# Altium project DE-180824.PrjPcb
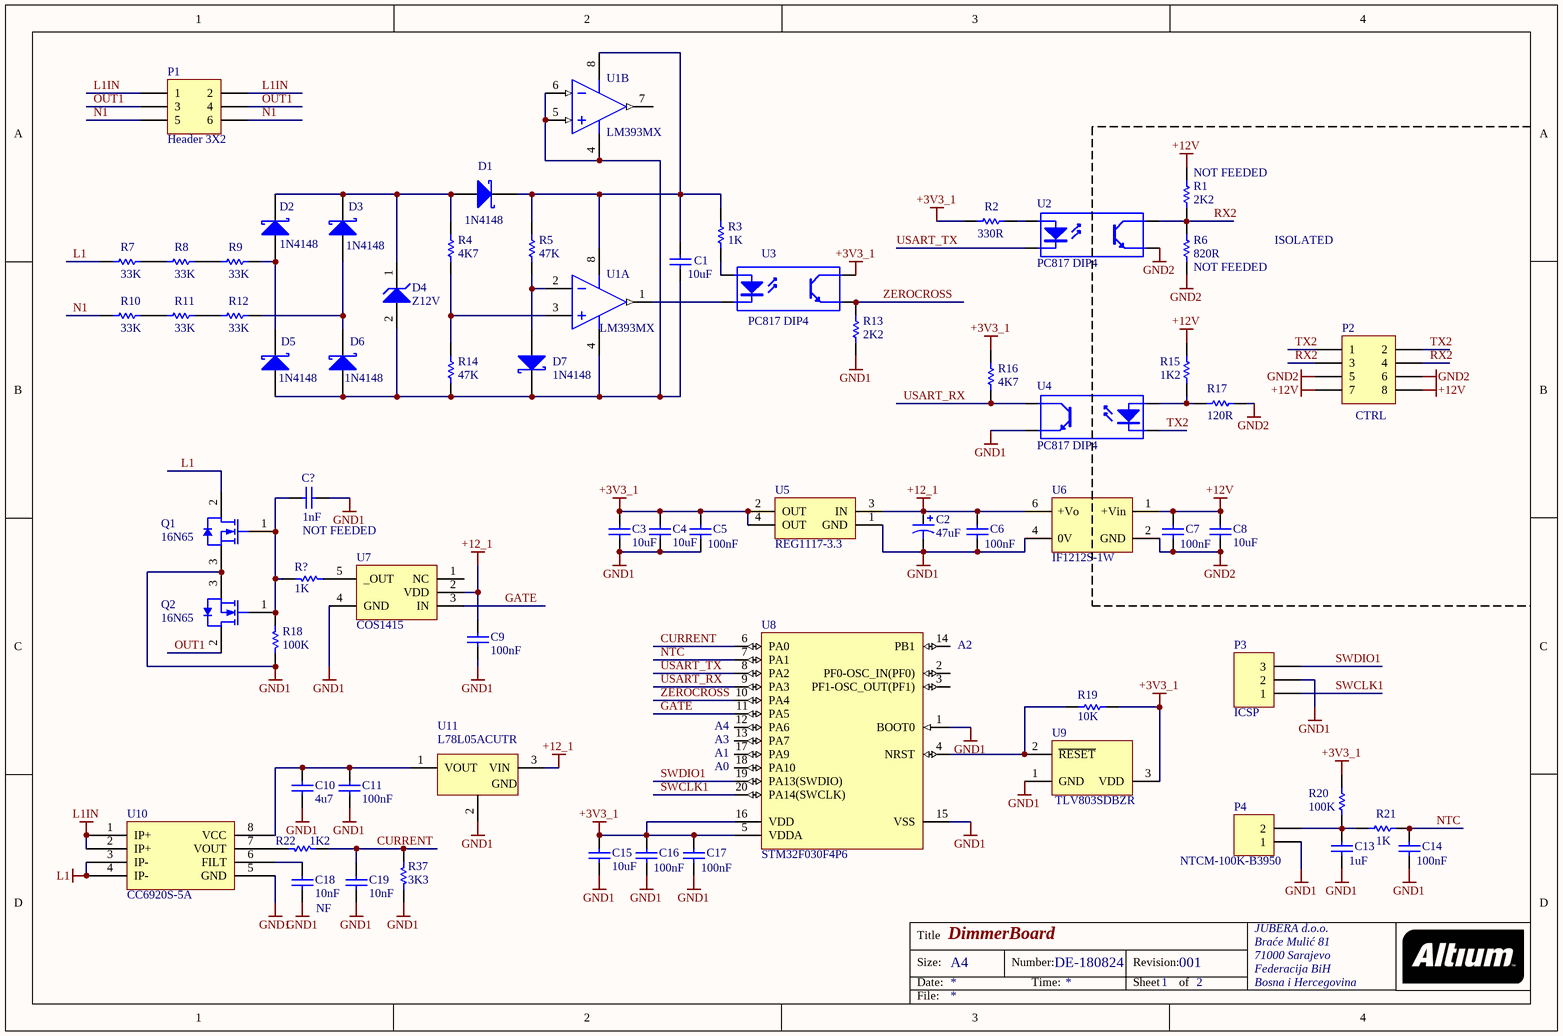
[diagram p0: DE-180824.SchDoc]
2 sheets, 134 parts. Net scope: global (net labels, ports and power ports of the same name join across sheets).
Board files: DE-180824.PcbDoc, PCB_BaseBoard.PcbDoc, PCB_ControlBoard.PcbDoc, PCB_DimmerBard.PcbDoc
Sheets:
  DE-180824.SchDoc
  DE-180824_1.SchDoc

## Sheet DE-180824.SchDoc: DimmerBoard
size A4; Author: eldar6776@hotmail.com; DrawnBy: Eldar Dedic; Organization: JUBERA d.o.o.; Address1: Braće Mulić 81; Address2: 71000 Sarajevo; Address3: Federacija BiH; Address4: Bosna i Hercegovina; DocumentNumber: DE-180824; Revision: 001; SheetNumber: 1; SheetTotal: 2; SPICEModelCacheBVBUIEPD: <root> / <DocumentId>BVBUIEPD</DocumentId> / </root>

### Parts
(Parts that share a designator on the sheet are numbered #1, #2 ... from top to bottom, then left to right.)
C1  value 10uF  [0805]
C2  47uF  [H]
C3  value 10uF  [0805]  (hidden comment: C0805)
C4  value 10uF  [0805]  (hidden comment: C0805)
C5  value 100nF  [0603]  (hidden comment: C0603)
C6  value 100nF  [0603]  (hidden comment: C0603)
C7  value 100nF  [0603]  (hidden comment: C0603)
C8  value 10uF  [0805]  (hidden comment: C0805)
C9  value 100nF  [0603]  (hidden comment: C0603)
C10  value 4u7  [0805]
C11  value 100nF  [0603]
C13  value 1uF  [0603]  (hidden comment: C0603)
C14  value 100nF  [0603]  (hidden comment: C0603)
C15  value 10uF  [0805]  (hidden comment: C0805)
C16  value 100nF  [0603]  (hidden comment: C0603)
C17  value 100nF  [0603]  (hidden comment: C0603)
C18  value 10nF  [0603]
C19  value 10nF  [0603]
C?  value 1nF  [0603]  (hidden comment: C0603)
D1  1N4148  [SOD323]
D2  1N4148  [SOD323]
D3  1N4148  [SOD323]
D4  Z12V  [ONSC-SOD-323-2-477-02_V]
D5  1N4148  [SOD323]
D6  1N4148  [SOD323]
D7  1N4148  [SOD323]
P1  Header 3X2  [HDR2X3]
P2  CTRL  [HDR2X4]
P3  ICSP  [HDR1X3]
P4  NTCM-100K-B3950  [HDR1X2]
Q1  16N65  [INF-PG-TO263-3-2_N]
Q2  16N65  [INF-PG-TO263-3-2_N]
R1  value 2K2  [ERA-0603]
R2  value 330R  [ERA-0603]  (hidden comment: 10K)
R3  value 1K  [ERA-0603]
R4  4K7  [ERA-0603]
R5  value 47K  [ERA-0603]
R6  value 820R  [ERA-0603]
R7  value 33K  [ERA-0805]
R8  value 33K  [ERA-0805]
R9  value 33K  [ERA-0805]
R10  value 33K  [ERA-0805]
R11  value 33K  [ERA-0805]
R12  value 33K  [ERA-0805]
R13  value 2K2  [ERA-0603]
R14  47K  [ERA-0603]
R15  value 1K2  [ERA-0603]
R16  value 4K7  [ERA-0603]  (hidden comment: 10K)
R17  value 120R  [ERA-0603]
R18  100K  [ERA-0805]
R19  10K  [ERA-0603]
R20  value 100K  [ERA-0603]  (hidden comment: 10K)
R21  1K  [ERA-0603]
R22  value 1K2  [ERA-0603]
R37  value 3K3  [ERA-0603]
R?#1  value 1K  [ERA-0805]  (hidden comment: 100K)
U1  LM393MX  [M08A_N]  (parts A,B of 2)
U2  PC817 DIP4  [DIP-4]
U3  PC817 DIP4  [DIP-4]
U4  PC817 DIP4  [DIP-4]
U5  REG1117-3.3  [ZZ311]
U6  IF1212S-1W  [IF1212S-1W]
U7  COS1415  [SOT23-5]
U8  STM32F030F4P6  [STM-TSSOP20_N]
U9  TLV803SDBZR  [DBZ3_N]
U10  CC6920S-5A  [SOIC-SN8_N]
U11  L78L05ACUTR  [SOT-89_N]

### Nets
+3V3_1: C3.2 C4.2 C5.2 C15.2 C16.2 C17.2 R2.2 R16.2 R19.2 R20.2 U3.4(C) U5.2(OUT) U5.4(OUT) U8.5(VDDA) U8.16(VDD) U9.3(VDD)
+12_1: C2.1 C6.2 C9.2 U5.3(IN) U6.6(+Vo) U7.2(VDD) U11.3(VIN)
+12V: C7.2 C8.2 P2.7 P2.8 R1.1 R15.1 U6.1(+Vin)
GND1: C2.2 C3.1 C4.1 C5.1 C6.1 C9.1 C10.1 C11.1 C13.1 C14.1 C15.1 C16.1 C17.1 C18.1 C19.1 C?.2 P3.2 P4.1 Q1.3(SOURCE) Q2.3(SOURCE) R13.1 R18.1 R37.2 U4.3(E) U5.1(GND) U6.4(0V) U7.4(GND) U8.1(BOOT0) U8.15(VSS) U9.1(GND) U10.5(GND) U11.2(GND)
GND2: C7.1 C8.1 P2.5 P2.6 R6.2 R17.2 U2.3(E) U6.2(GND)
L1: Q1.2(DRAIN) R7.1 U10.3(IP-) U10.4(IP-)
L1IN: P1.1 P1.2 U10.1(IP+) U10.2(IP+)
CURRENT: C19.2 R22.1 R37.1 U8.6(PA0)
GATE: U7.3(IN) U8.11(PA5)
N1: P1.5 P1.6 R10.1
NTC: C14.2 R21.1 U8.7(PA1)
OUT1: P1.3 P1.4 Q2.2(DRAIN)
RX2: P2.3 P2.4 R1.2 R6.1 U2.4(C)
SWCLK1: P3.1 U8.20(PA14(SWCLK))
SWDIO1: P3.3 U8.19(PA13(SWDIO))
TX2: P2.1 P2.2 U4.2(K)
USART_RX: R16.1 U4.4(C) U8.9(PA3)
USART_TX: U2.2(K) U8.8(PA2)
ZEROCROSS: R13.2 U3.3(E) U8.10(PA4)
NetC1_1: C1.1 D4.2(A) D5.2(A) D6.2(A) D7.1(K) R14.1 U1.4(GND) U1.5(INB+) U1.6(INB-)
NetC1_2: C1.2 D1.1(K) R3.2 R5.2 U1.8(V+)
NetC10_2: C10.2 C11.2 U10.8(VCC) U11.1(VOUT)
NetC13_2: C13.2 P4.2 R20.1 R21.2
NetC18_2: C18.2 U10.6(FILT)
NetC?_1: C?.1 Q1.1(GATE) Q2.1(GATE) R18.2 R?#1.2
NetD1_2: D1.2(A) D2.1(K) D3.1(K) D4.1(K) R4.2
NetD2_2: D2.2(A) D5.1(K) R9.2
NetD3_2: D3.2(A) D6.1(K) R12.2
NetD7_2: D7.2(A) R5.1 U1.2(INA-)
NetR2_1: R2.1 U2.1(A)
NetR3_1: R3.1 U3.1(A)
NetR4_1: R4.1 R14.2 U1.3(INA+)
NetR7_2: R7.2 R8.1
NetR8_2: R8.2 R9.1
NetR10_2: R10.2 R11.1
NetR11_2: R11.2 R12.1
NetR15_2: R15.2 R17.1 U4.1(A)
NetR19_1: R19.1 U8.4(NRST) U9.2(~{RESET})
NetR22_2: R22.2 U10.7(VOUT)
NetU1_1: U1.1(OUTA) U3.2(K)

Not connected (* = marked no-connect by the designer): R?#1 1; U1 7(OUTB); U7 1(NC) 5(_OUT); U8 2(PF0-OSC_IN(PF0)) 3(PF1-OSC_OUT(PF1)) 12(PA6) 13(PA7) 14(PB1) 17(PA9) 18(PA10)

### Notes on the sheet
- (near R1) NOT FEEDED
- ISOLATED
- (near R6) NOT FEEDED
- NOT FEEDED
- (near U8) A2
- (near U8) A4
- (near U8) A3
- (near U8) A1
- (near U8) A0
- NF
- Title
- Size:
- Date:
- Number:
- Time:
- Revision:
- Sheet
- of
- File:

### Library data of the parts
C1 C3 C4 C8 C10 C15 = C0805: Ceramic Chip Capacitor - Standard; Note: Footprint corresponds to dimensions for bulk cassette packaging. This case size has tightened tolerances.; Published: 17-Jul-2002; LatestRevisionDate: 19-Mar-2004; LatestRevisionNote: Silkscreen size reduced.; DatasheetDocument: Mar-2001; PackageDocument: Mar-2001; PackageReference: 0805; Publisher: Altium Limited; Code_JEITA: 0805; Code_IPC: 2012[0805]; ComponentLink1Description: Manufacturer Link; ComponentLink1URL: http://www.kemet.com/; ComponentLink2Description: Datasheet; ComponentLink2URL: http://www.kemet.com/kemet/web/homepage/kechome.nsf/vapubfilesname/F3102TA.pdf/$file/F3102TA.pdf
C2 = 194D476X0015H2: Midget Conformal Coated Solid Tantalum Chip Capacitor: 47uF, 20% Tolerance, 15 WVDC @ +85°C, Surge = 20V; Note: See Data Sheet for full range of components; Published: 19-Mar-2004; DatasheetDocument: 05-Jul-2002; PackageReference: H; Publisher: Altium Limited; ComponentLink1Description: Manufacturer Link; ComponentLink1URL: http://www.vishay.com/; ComponentLink2Description: Datasheet; ComponentLink2URL: http://www.vishay.com/docs/40000/194d.pdf; Value: 47uF
C5-C7 C9 C11 C13 C14 C16-C19 C? = C0603: Ceramic Chip Capacitor - Standard; Note: Footprint corresponds to dimensions for bulk cassette packaging. This case size has tightened tolerances.; Published: 17-Jul-2002; LatestRevisionDate: 19-Mar-2004; LatestRevisionNote: Silkscreen size reduced.; DatasheetDocument: Mar-2001; PackageDocument: Mar-2001; PackageReference: 0603; Publisher: Altium Limited; Code_JEITA: 0603; Code_IPC: 1608 [0603]; ComponentLink1Description: Manufacturer Link; ComponentLink1URL: http://www.kemet.com/; ComponentLink2Description: Datasheet; ComponentLink2URL: http://www.kemet.com/kemet/web/homepage/kechome.nsf/vapubfilesname/F3102TA.pdf/$file/F3102TA.pdf
D1-D3 D5-D7 = 1PS76SB10: Schottky Barrier Diode; Published: 17-Sep-2003; LatestRevisionDate: 19-Mar-2004; LatestRevisionNote: Silkscreen size reduced.; DatasheetVersion: 14-Oct-1996; PackageVersion: May-1999; PackageReference: SOD323; Publisher: Altium Limited; PackageDescription: SOD-323/SC-76; 2 Leads; Body 1.7 x 1.3 mm, (LxW); ComponentLink1Description: Manufacturer Link; ComponentLink1URL: http://www.semiconductors.philips.com/; ComponentLink2Description: Datasheet; ComponentLink2URL: http://www.semiconductors.philips.com/acrobat/datasheets/1PS76SB10_2.pdf
D4 = SZMM3Z12VT1G: Zener Voltage Regulator, 300 mW, 2-Pin SOD-323, Pb-Free, Tape and Reel; Manufacturer: On Semiconductor; P Max (W): 0.3; VZ Typ (V): 12; DatasheetVersion: Rev. 9; PackageVersion: Rev. H, 03/2007; PackageReference: SOD-323-2-477-02; PackageDescription: 2-Pin SOD, Body 1.7 x 1.25 mm; Supplier 1: Digi-Key; Supplier Part Number 1: SZMM3Z12VT1G-ND; Supplier 2: Mouser; Supplier Part Number 2: 863-SZMM3Z12VT1G; Packing: Tape and Reel; RoHS: Pb-Free; Mounting Technology: Surface Mount; PartNumber: SZMM3Z12VT1G; ComponentLink1Description: Manufacturer URL; ComponentLink1URL: http://www.onsemi.com/; ComponentLink2Description: Datasheet; ComponentLink2URL: http://www.onsemi.cn/pub_link/Collateral/MM3Z2V4T1-D.PDF; ComponentLink3Description: Package Specification; ComponentLink3URL: http://www.onsemi.com/pub_link/Collateral/477-02.PDF.1
P1 = Header 3X2: Header, 3-Pin, Dual row; LatestRevisionDate: 17-Jul-2002; LatestRevisionNote: Re-released for DXP Platform.; Publisher: Altium Limited
P2 = Header 4X2: Header, 4-Pin, Dual row; LatestRevisionDate: 17-Jul-2002; LatestRevisionNote: Re-released for DXP Platform.; Publisher: Altium Limited
P3 = Header 3: Header, 3-Pin; LatestRevisionDate: 17-Jul-2002; LatestRevisionNote: Re-released for DXP Platform.; Publisher: Altium Limited
P4 = Header 2: Header, 2-Pin; LatestRevisionDate: 17-Jul-2002; LatestRevisionNote: Re-released for DXP Platform.; Publisher: Altium Limited
Q1 Q2 = IPB020NE7N3 G: N-Channel OptiMOS 3 Power-Transistor, 75 V VDS, 120 A ID, -55 to 175 degC, PG-TO263-3-2, Reel, Green; Manufacturer: Infineon; Green: TRUE; ID (max): 120 A; IDpuls (max): 480 A; Polarity: N; Ptot (max): 300 W; QG: 155 nC; RDS (on) (max): 2 mOhm; Rth: 0.5 K/W; RthJA (max): 62 K/W; VDS (max): 75 V; VGS(th) (max): 3.8 V; VGS(th) (min): 2.3 V; DatasheetVersion: Rev. 2.2; PackageVersion: Jul-09; PackageReference: PG-TO263-3-2; PackageDescription: 3-Pin Plastic (Green) Transistor Single Outline Package, 10 x 9.25 mm Body, 2.54 mm Pitch; Supplier 1: Mouser; Supplier Part Number 1: 726-IPB020NE7N3GXT; Supplier 2: Digi-Key; Supplier Part Number 2: IPB020NE7N3 GTR-ND; Supplier 3: Digi-Key; Supplier Part Number 3: IPB020NE7N3 GCT-ND; Supplier 4: Digi-Key; Supplier Part Number 4: IPB020NE7N3 GDKR-ND; Halogen-free: TRUE; Packing: Reel; RthJC (max): 0.5 K/W; Mounting Technology: Surface Mount; PartNumber: IPB020NE7N3 G; ComponentLink1Description: Manufacturer URL; ComponentLink1URL: http://www.infineon.com/; ComponentLink2Description: Datasheet; ComponentLink2URL: http://www.infineon.com/dgdl/IPB020NE7N3_Rev2.2.pdf?folderId=db3a304313b8b5a60113cee8763b02d7&fileId=db3a304320d39d590121e31c838554d3; ComponentLink3Description: Package Specification; ComponentLink3URL: http://www.infineon.com/dgdl/BTS141TC_DS_10.pdf?folderId=db3a3043163797a6011667aa084c0e01&fileId=db3a3043242ebc9e01242f43f58b003e&location=en.Products.Automotive_ICs.Smart_High-_and_Low-Side_Switches.HITFET___TEMPFET__-_Smart_Low-Side_Switches.DATASHEET.BTS141TC_DS_10.pdf
R1-R6 R13-R17 R19-R22 R37 = ERA3Y: Rectangular Thick Film Chip Resistor, 10 Ohm to 330k Ohm Range, 0.1% and 0.5% Tolerance, 0603 Size, 0.063 W; Note: If flow soldering, adjust pad width of PCB Footprint to 0.7 - 0.8 times the width of the resistor.; Published: 17-Dec-2003; LatestRevisionDate: 19-Mar-2004; LatestRevisionNote: Silkscreen size reduced.; PackageDocument: Mar-2003; PackageReference: ERA-0603; Publisher: Altium Limited; Code_IPC: 1608 [0603]; ComponentLink1Description: Manufacturer Link; ComponentLink1URL: http://www.panasonic.com/industrial/components/resistive_products.htm; ComponentLink2Description: Datasheet; ComponentLink2URL: http://www.panasonic.com/industrial/components/pdf/AOA0000CE8.pdf
  R21: Value: 1K
R7-R12 = ERA6Y: Rectangular Thick Film Chip Resistor, 10 Ohm to 1M Ohm Range, 0.1% and 0.5% Tolerance, 0805 Size, 0.1 W; Note: If flow soldering, adjust pad width of PCB Footprint to 0.7 - 0.8 times the width of the resistor.; Published: 17-Dec-2003; LatestRevisionDate: 19-Mar-2004; LatestRevisionNote: Silkscreen size reduced.; PackageDocument: Mar-2003; PackageReference: ERA-0805; Publisher: Altium Limited; Code_IPC: 2012 [0805]; ComponentLink1Description: Manufacturer Link; ComponentLink1URL: http://www.panasonic.com/industrial/components/resistive_products.htm; ComponentLink2Description: Datasheet; ComponentLink2URL: http://www.panasonic.com/industrial/components/pdf/AOA0000CE8.pdf
R18 R?#1 = ERAS: Metal Film Thermosensitive Chip Resistor, 0.56 Ohm to 10k Ohm Range, 5% Tolerance, 0805 Size, 0.1 W; Note: If flow soldering, adjust pad width of PCB Footprint to 0.7 - 0.8 times the width of the resistor.; Published: 17-Dec-2003; LatestRevisionDate: 19-Mar-2004; LatestRevisionNote: Silkscreen size reduced.; PackageDocument: Mar-2003; PackageReference: ERA-0805; Publisher: Altium Limited; Code_IPC: 2012 [0805]; ComponentLink1Description: Manufacturer Link; ComponentLink1URL: http://www.panasonic.com/industrial/components/resistive_products.htm; ComponentLink2Description: Datasheet; ComponentLink2URL: http://www.panasonic.com/industrial/components/pdf/AOF0000CE1.pdf
  R18: Value: 100K
U1 = LM393MX: Low Power Low Offset Voltage Dual Comparator, 8-pin Narrow SOIC; Manufacturer: National Semiconductor; PackageTopMarking: NSZXTT*LM*393M; PowerWise: N; High-Reliability: Y; DatasheetVersion: Aug-2002; PackageVersion: revM, May-2009; PackageReference: M08A; PackageDescription: SOIC Narrow, 4.9 x 3.9 x 1.45mm, 8 Lead, 1.27mm Pitch; PartNumber: LM393MX; RoHS: N; PinCount: 8; CompType: Comparator; Code_JEDEC: MS-012-AA; Code_IPC: SOIC127P600-8; ComponentLink1Description: Manufacturer URL; ComponentLink1URL: http://www.national.com/; ComponentLink2Description: LM393 Datasheet; ComponentLink2URL: http://www.national.com/ds/LM/LM393.pdf; ComponentLink3Description: LM393 Web Page; ComponentLink3URL: http://www.national.com/pf/LM/LM393.html; ComponentLink4Description: M08A Package Page; ComponentLink4URL: http://www.national.com/packaging/folders/m08a.html
U2-U4 = PC817 DIP4: 4-Pin Phototransistor Optocoupler; Published: 24-Mar-1999; LatestRevisionDate: 04-Mar-2005; LatestRevisionNote: Sch pins 3 & 4 Swapped.; DatasheetVersion: Nov-2003; PackageReference: DIP-4; Publisher: Altium Limited
U5 = REG1117-3.3: 800mA and 1A Low Dropout Positive Regulator 2.85V, 3.3V, 5V, and Adjustable; Published: 8-Jun-2000; LatestRevisionDate: 17-Jul-2002; LatestRevisionNote: Re-released for DXP Platform.; DatasheetVersion: Sep-1997; PackageVersion: revC; PackageReference: ZZ311; Publisher: Altium Limited; PackageDescription: SOT-223/SC-73; 4 Leads; Body 6.7 x 7.3 mm, inc. leads (LxW max); ComponentLink1Description: Manufacturer Link; ComponentLink1URL: http://www.ti.com/; ComponentLink2Description: Datasheet; ComponentLink2URL: http://www-s.ti.com/sc/ds/REG1117.pdf
U6 = IF1212S-1W: 1W isolated dc dc converter
U7 = COS1415: 1.5A Single-Channel / High-Speed Power MOSFETDriver
U8 = STM32F030F4P6: ARM Cortex-M0 32-bit MCU, 16 KB Flash, 4 KB Internal RAM, 15 I/Os, 20-pin TSSOP, -40 to 85 degC, Tube; FLASH Size (Prog) (kB): 16; I/Os (High Current): 15; Internal RAM Size (kB): 4; Operating Frequency(F) (Processor speed) (MHz): 48; Supply Voltage(Vcc) min (V): 2.4; DatasheetVersion: Rev. 1; PackageVersion: Rev. 1, 11/2012; PackageReference: TSSOP20; PackageDescription: 20-Pin Thin Shrink Small Outline Package, 6.5 x 4.4 mm Body, 0.65 mm Pitch; Supplier 1: Digi-Key; Supplier Part Number 1: 497-14044-5-ND; Supplier 2: Newark; Supplier Part Number 2: 06X3648; Supplier 3: Mouser; Supplier Part Number 3: 511-STM32F030F4P6; Core: ARM Cortex-M0; Packing: Tube; Mounting Technology: Surface Mount; PartNumber: STM32F030F4P6; ComponentLink1Description: Manufacturer URL; ComponentLink1URL: http://www.st.com/web/en/home.html; ComponentLink2Description: Datasheet; ComponentLink2URL: http://www.st.com/st-web-ui/static/active/en/resource/technical/document/datasheet/DM00088500.pdf; ComponentLink3Description: Package Specification; ComponentLink3URL: http://www.st.com/st-web-ui/static/active/en/resource/technical/document/datasheet/DM00065136.pdf
U9 = TLV803MDBZR: Voltage Supervisor with Active-Low, Open Drain Reset, 1 Supply Monitored, -40 to 125 degC, 3-pin SOT-23 (DBZ), Green (RoHS & no Sb/Br); Manufacturer: Texas Instruments; # of supplies monitored: 1; Iq(Typ)(uA): 9; Output Driver Type / Reset Output: Active-low, Open-drain; Rating: Catalog; Reset Threshold Accuracy(%): 2; SubFamily: Supervisor and Reset IC; Threshold Voltage 1 (typ)(Typ)(V): 4.38; Time Delay(ms): 200; VCC(Max)(V): 6; VCC(Min)(V): 1.1; DatasheetVersion: SBVS157B; PackageVersion: revB, Apr-2005; PackageReference: DBZ3; PackageDescription: 3-Pin Plastic Small-Outline Package, 0.95 mm Pitch, 2.4 mm Lead Span; Supplier 1: Digi-Key; Supplier Part Number 1: 296-29194-2-ND; Supplier 2: Digi-Key; Supplier Part Number 2: 296-29194-1-ND; Supplier 3: Digi-Key; Supplier Part Number 3: 296-29194-6-ND; Supplier 4: Newark; Supplier Part Number 4: 58T0286; Supplier 5: Mouser; Supplier Part Number 5: 595-TLV803MDBZR; Mounting Technology: Surface Mount; Code_JEDEC: TO-236-AB; PartNumber: TLV803MDBZR; ComponentLink1Description: Datasheet; ComponentLink1URL: http://www.ti.com/general/docs/lit/getliterature.tsp?genericPartNumber=TLV803M&fileType=pdf
U10 = ACS71240
U11 = L78L05ACUTR: Positive Voltage Regulator, 5V, 4-Pin SOT-89, Tape and Reel; DatasheetVersion: Feb-2011; PackageVersion: 2011; PackageReference: SOT-89; PackageDescription: 3-Pin SOT-89 Package 1.5 mm Pitch, 4.1 mm Lead Span; PartNumber: L78L05ACUTR; ComponentLink1Description: Manufacturer URL; ComponentLink1URL: http://www.st.com; ComponentLink2Description: Datasheet; ComponentLink2URL: http://www.st.com/internet/com/TECHNICAL_RESOURCES/TECHNICAL_LITERATURE/DATASHEET/CD00000446.pdf

## Sheet DE-180824_1.SchDoc: DimmerBaseBoard
size A3; Author: eldar6776@hotmail.com; DrawnBy: Eldar Dedic; Organization: JUBERA d.o.o.; Address1: Braće Mulić 81; Address2: 71000 Sarajevo; Address3: Federacija BiH; Address4: Bosna i Hercegovina; DocumentNumber: DE-180824; Revision: 001; SheetNumber: 2; SheetTotal: 2; SPICEModelCacheBVBUIEPD: <root> / <DocumentId>BVBUIEPD</DocumentId> / <CacheFrame Number="0"> / <Model Name="dpsw6" Kind="CKT"> / <Text>* DIP switch 6 / * jjt 20/6/2002: created / * / *             Switch connections: / *             sw1 / *             |  |  sw2 / *             |  |  |  |  sw3 / *             |  |  |  |  |  |   sw4 / *             |  |  |  |  |  |  |   |    sw5 / *             |  |  |  |  |  |  |   |   |   |    sw6 / *             |  |  |  |  |  |  |   |   |   |   |   | / *             |  |  |  |  |  |  |   |   |   |   |   | / .subckt dpsw6 1  2  4  5  7  8  10  11  13  14  16  17 / + PARAMS: STATE1=0 STATE2=0 STATE3=0 STATE4=0 STATE5=0 STATE6=0 RON=1m ROFF=100E6 / * / V1 3  0 {STATE1} / V2 6  0 {STATE2} / V3 9  0 {STATE3} / V4 12 0 {STATE4} / V5 15 0 {STATE5} / V6 18 0 {STATE6} / * / SDIP1 1  2  3  0 DIPMOD / SDIP2 4  5  6  0 DIPMOD / SDIP3 7  8  9  0 DIPMOD / SDIP4 10 11 12 0 DIPMOD / SDIP5 13 14 15 0 DIPMOD / SDIP6 16 17 18 0 DIPMOD / * / .MODEL DIPMOD SW(VT=0.5 RON={RON} ROFF={ROFF}) / .ends dpsw6</Text> / </Model> / </CacheFrame> / </root>
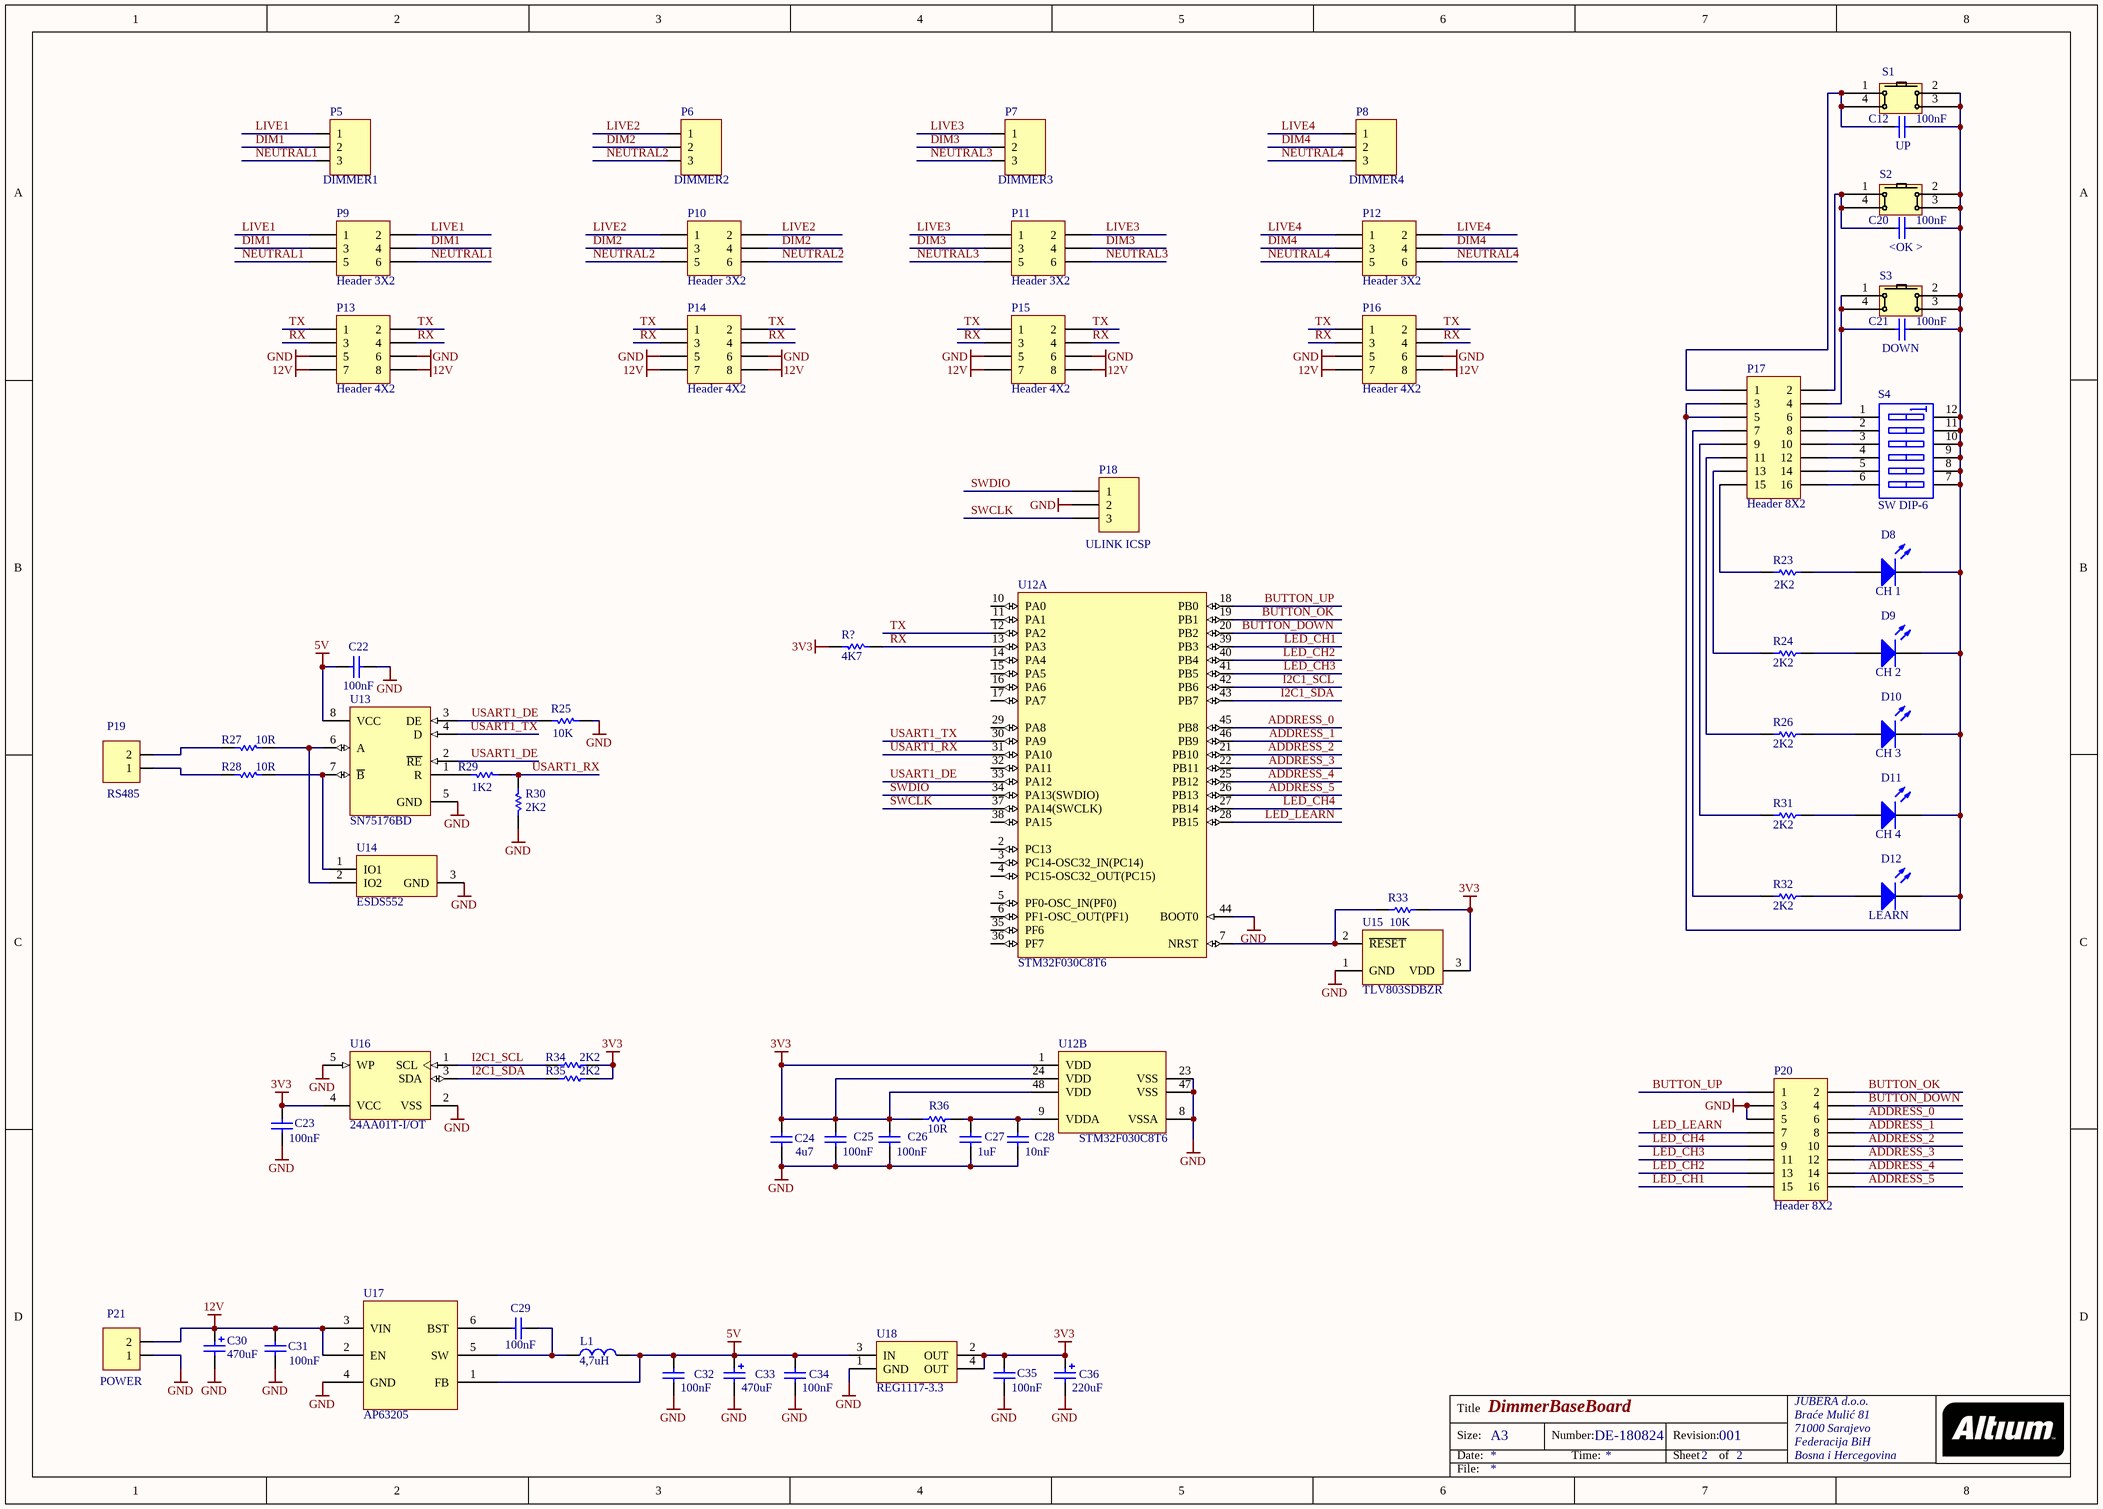
[diagram p1: DE-180824_1.SchDoc]

### Parts
(Parts that share a designator on the sheet are numbered #1, #2 ... from top to bottom, then left to right.)
C12  value 100nF  [0603]  (hidden comment: C0603)
C20  value 100nF  [0603]  (hidden comment: C0603)
C21  value 100nF  [0603]  (hidden comment: C0603)
C22  100nF  [0603]
C23  value 100nF  [0603]
C24  4u7  [0805]
C25  100nF  [0603]
C26  100nF  [0603]
C27  1uF  [0603]
C28  10nF  [0603]
C29  value 100nF  [0603]
C30  470uF  [ROQANG VT1V471M1010]
C31  value 100nF  [0603]
C32  value 100nF  [0603]
C33  470uF  [SMD,D6.3xL7.7mm Aluminum Electrolytic Capacitors]
C34  value 100nF  [0603]
C35  value 100nF  [0603]
C36  value 220uF  [SMD,D6.3xL7.7mm Aluminum Electrolytic Capacitors]
D8  CH 1  [1.6X0.8X0.8]
D9  CH 2  [1.6X0.8X0.8]
D10  CH 3  [1.6X0.8X0.8]
D11  CH 4  [1.6X0.8X0.8]
D12  LEARN  [1.6X0.8X0.8]
L1  value 4,7uH  [XRNR4030-4.7uH/M]
P5  DIMMER1  [TERMINAL BLOK 3]
P6  DIMMER2  [TERMINAL BLOK 3]
P7  DIMMER3  [TERMINAL BLOK 3]
P8  DIMMER4  [TERMINAL BLOK 3]
P9  Header 3X2  [HDR2X3]
P10  Header 3X2  [HDR2X3]
P11  Header 3X2  [HDR2X3]
P12  Header 3X2  [HDR2X3]
P13  Header 4X2  [HDR2X4]
P14  Header 4X2  [HDR2X4]
P15  Header 4X2  [HDR2X4]
P16  Header 4X2  [HDR2X4]
P17  Header 8X2  [HDR2X8]
P18  ULINK ICSP  [HDR1X3]
P19  RS485  [TERMINAL BLOK 2]
P20  Header 8X2  [HDR2X8]
P21  POWER  [TERMINAL BLOK 2]
R23  2K2  [ERA-0603]
R24  2K2  [ERA-0603]
R25  10K  [ERA-0603]
R26  2K2  [ERA-0603]
R27  10R  [ERA-0603]
R28  10R  [ERA-0603]
R29  1K2  [ERA-0603]
R30  2K2  [ERA-0603]
R31  2K2  [ERA-0603]
R32  2K2  [ERA-0603]
R33  10K  [ERA-0603]
R34  2K2  [ERA-0603]
R35  2K2  [ERA-0603]
R36  10R  [ERA-0603]
R?#2  value 4K7  [ERA-0603]  (hidden comment: 10K)
S1  UP  [TACTILE_SWITCH]
S2  <OK >  [TACTILE_SWITCH]
S3  DOWN  [TACTILE_SWITCH]
S4  SW DIP-6  [DIP-12/SW]
U12  STM32F030C8T6  [STM-LQFP48_N]  (parts A,B of 2)
U13  SN75176BD  [D008_N]
U14  ESDS552  [DCK3_N]
U15  TLV803SDBZR  [DBZ3_N]
U16  24AA01T-I/OT  [SOT-23-OT5_N]
U17  AP63205  [TSOT-26]
U18  REG1117-3.3  [ZZ311]

### Nets
3V3: C23.2 C24.1 C25.1 C26.1 C35.2 C36.1 R33.2 R34.2 R35.2 R36.2 R?#2.1 U12.1(VDD) U12.24(VDD) U12.48(VDD) U15.3(VDD) U16.4(VCC) U18.2(OUT) U18.4(OUT)
5V: C22.1 C32.2 C33.1 C34.2 L1.1 U13.8(VCC) U17.1(FB) U18.3(IN)
12V: C30.1 C31.2 P13.7 P13.8 P14.7 P14.8 P15.7 P15.8 P16.7 P16.8 P21.2 U17.2(EN) U17.3(VIN)
GND: C22.2 C23.1 C24.2 C25.2 C26.2 C27.2 C28.2 C30.2 C31.1 C32.1 C33.2 C34.1 C35.1 C36.2 P13.5 P13.6 P14.5 P14.6 P15.5 P15.6 P16.5 P16.6 P18.2 P20.3 P20.5 P21.1 R25.1 R30.2 U12.8(VSSA) U12.23(VSS) U12.44(BOOT0) U12.47(VSS) U13.5(GND) U14.3(GND) U15.1(GND) U16.2(VSS) U16.5(WP) U17.4(GND) U18.1(GND)
ADDRESS_0: P20.6 U12.45(PB8)
ADDRESS_1: P20.8 U12.46(PB9)
ADDRESS_2: P20.10 U12.21(PB10)
ADDRESS_3: P20.12 U12.22(PB11)
ADDRESS_4: P20.14 U12.25(PB12)
ADDRESS_5: P20.16 U12.26(PB13)
BUTTON_DOWN: P20.4 U12.20(PB2)
BUTTON_OK: P20.2 U12.19(PB1)
BUTTON_UP: P20.1 U12.18(PB0)
DIM1: P5.2 P9.3 P9.4
DIM2: P6.2 P10.3 P10.4
DIM3: P7.2 P11.3 P11.4
DIM4: P8.2 P12.3 P12.4
I2C1_SCL: R34.1 U12.42(PB6) U16.1(SCL)
I2C1_SDA: R35.1 U12.43(PB7) U16.3(SDA)
LED_CH1: P20.15 U12.39(PB3)
LED_CH2: P20.13 U12.40(PB4)
LED_CH3: P20.11 U12.41(PB5)
LED_CH4: P20.9 U12.27(PB14)
LED_LEARN: P20.7 U12.28(PB15)
LIVE1: P5.1 P9.1 P9.2
LIVE2: P6.1 P10.1 P10.2
LIVE3: P7.1 P11.1 P11.2
LIVE4: P8.1 P12.1 P12.2
NEUTRAL1: P5.3 P9.5 P9.6
NEUTRAL2: P6.3 P10.5 P10.6
NEUTRAL3: P7.3 P11.5 P11.6
NEUTRAL4: P8.3 P12.5 P12.6
RX: P13.3 P13.4 P14.3 P14.4 P15.3 P15.4 P16.3 P16.4 R?#2.2 U12.13(PA3)
SWCLK: P18.3 U12.37(PA14(SWCLK))
SWDIO: P18.1 U12.34(PA13(SWDIO))
TX: P13.1 P13.2 P14.1 P14.2 P15.1 P15.2 P16.1 P16.2 U12.12(PA2)
USART1_DE: R25.2 U12.33(PA12) U13.2(~{RE}) U13.3(DE)
USART1_RX: R29.1 R30.1 U12.31(PA10)
USART1_TX: U12.30(PA9) U13.4(D)
NetC12_1: C12.1 P17.1 S1.1 S1.4
NetC12_2: C12.2 C20.2 C21.2 D8.2(K) D9.2(K) D10.2(K) D11.2(K) D12.2(K) P17.3 P17.5 S1.2 S1.3 S2.2 S2.3 S3.2 S3.3 S4.7(B6) S4.8(B5) S4.9(B4) S4.10(B3) S4.11(B2) S4.12(B1)
NetC20_1: C20.1 P17.2 S2.1 S2.4
NetC21_1: C21.1 P17.4 S3.1 S3.4
NetC27_1: C27.1 C28.1 R36.1 U12.9(VDDA)
NetC29_1: C29.1 L1.2 U17.5(SW)
NetC29_2: C29.2 U17.6(BST)
NetD8_1: D8.1(A) R23.2
NetD9_1: D9.1(A) R24.2
NetD10_1: D10.1(A) R26.2
NetD11_1: D11.1(A) R31.2
NetD12_1: D12.1(A) R32.2
NetP17_6: P17.6 S4.1(A1)
NetP17_7: P17.7 R32.1
NetP17_8: P17.8 S4.2(A2)
NetP17_9: P17.9 R31.1
NetP17_10: P17.10 S4.3(A3)
NetP17_11: P17.11 R26.1
NetP17_12: P17.12 S4.4(A4)
NetP17_13: P17.13 R24.1
NetP17_14: P17.14 S4.5(A5)
NetP17_15: P17.15 R23.1
NetP17_16: P17.16 S4.6(A6)
NetP19_1: P19.1 R28.1
NetP19_2: P19.2 R27.1
NetR27_2: R27.2 U13.6(A) U14.2(IO2)
NetR28_2: R28.2 U13.7(~{B}) U14.1(IO1)
NetR29_2: R29.2 U13.1(R)
NetR33_1: R33.1 U12.7(NRST) U15.2(~{RESET})

Not connected (* = marked no-connect by the designer): U12 2(PC13) 3(PC14-OSC32_IN(PC14)) 4(PC15-OSC32_OUT(PC15)) 5(PF0-OSC_IN(PF0)) 6(PF1-OSC_OUT(PF1)) 10(PA0) 11(PA1) 14(PA4) 15(PA5) 16(PA6) 17(PA7) 29(PA8) 32(PA11) 35(PF6) 36(PF7) 38(PA15)

### Notes on the sheet
- Title
- Size:
- Date:
- A3
- Number:
- Time:
- Revision:
- Sheet
- of
- File:

### Library data of the parts
C12 C20-C23 C25-C28 C31 C35 = C0603: as C5 on sheet DE-180824; Published: 17-Jul-2002; LatestRevisionDate: 19-Mar-2004; LatestRevisionNote: Silkscreen size reduced.; DatasheetDocument: Mar-2001; PackageDocument: Mar-2001; PackageReference: 0603; Publisher: Altium Limited; Code_JEITA: 0603; Code_IPC: 1608 [0603]; ComponentLink1Description: Manufacturer Link; ComponentLink1URL: http://www.kemet.com/; ComponentLink2Description: Datasheet; ComponentLink2URL: http://www.kemet.com/kemet/web/homepage/kechome.nsf/vapubfilesname/F3102TA.pdf/$file/F3102TA.pdf
  C22 C25 C26: Value: 100nF
  C27: Value: 1uF
  C28: Value: 10nF
C24 = C0805: as C1 on sheet DE-180824; Published: 17-Jul-2002; LatestRevisionDate: 19-Mar-2004; LatestRevisionNote: Silkscreen size reduced.; DatasheetDocument: Mar-2001; PackageDocument: Mar-2001; PackageReference: 0805; Publisher: Altium Limited; Code_JEITA: 0805; Code_IPC: 2012[0805]; ComponentLink1Description: Manufacturer Link; ComponentLink1URL: http://www.kemet.com/; ComponentLink2Description: Datasheet; ComponentLink2URL: http://www.kemet.com/kemet/web/homepage/kechome.nsf/vapubfilesname/F3102TA.pdf/$file/F3102TA.pdf; Value: 4u7
C29 C32 C34 = C0603: Ceramic Chip Capacitor - 25V; Note: Footprint corresponds to dimensions for bulk cassette packaging. This case size has tightened tolerances.; Published: 17-Jul-2002; LatestRevisionDate: 19-Mar-2004; LatestRevisionNote: Silkscreen size reduced.; DatasheetDocument: Mar-2001; PackageDocument: Mar-2001; PackageReference: 0603; Publisher: Altium Limited; Code_JEITA: 0603; Code_IPC: 1608 [0603]; ComponentLink1Description: Manufacturer Link; ComponentLink1URL: http://www.kemet.com/; ComponentLink2Description: Datasheet; ComponentLink2URL: http://www.kemet.com/kemet/web/homepage/kechome.nsf/vapubfilesname/F3102TA.pdf/$file/F3102TA.pdf
C30 = ROQANG VT1C221M0607: 220uF 16V 110mA@120Hz ±20% SMD,D6.3xL7.7mm Aluminum Electrolytic Capacitors - SMD ROHS; Note: Refer to Manufacturer's Data Sheets for other lead formations; DrillSize: Nominal, Rounded To The Nearest 0.1mm; Value: 10uF; Published: 19-Mar-2004; DatasheetDocument: 20-Feb-2001; PackageReference: CAPPR2-5X11; Publisher: Altium Limited; ComponentLink1Description: Manufacturer Link; ComponentLink1URL: http://www.vishay.com/; ComponentLink2Description: Datasheet; ComponentLink2URL: http://www.vishay.com/docs/25014/eka.pdf
C33 C36 = ROQANG VT1C221M0607: 220uF 16V 110mA@120Hz ±20% SMD,D6.3xL7.7mm Aluminum Electrolytic Capacitors - SMD ROHS; Note: Refer to Manufacturer's Data Sheets for other lead formations; DrillSize: Nominal, Rounded To The Nearest 0.1mm; Published: 19-Mar-2004; DatasheetDocument: 20-Feb-2001; PackageReference: CAPPR2-5X11; Publisher: Altium Limited; ComponentLink1Description: Manufacturer Link; ComponentLink1URL: http://www.vishay.com/; ComponentLink2Description: Datasheet; ComponentLink2URL: http://www.vishay.com/docs/25014/eka.pdf
  C33: Value: 470uF
D8-D12 = HSMZ-C190: High Performance Chip LED, Red; LuminousIntensity: 40mcd (Minimum).; PCB_Layout: Complies with manufacturer's recommendation.; Published: 11-Dec-2002; DatasheetDocument: 11-Mar-2002; PackageDocument: 11-Mar-2002; PackageReference: 1.6X0.8X0.8; Publisher: Altium Limited; LED_Colour: Red; ComponentLink1Description: Manufacturer Link; ComponentLink1URL: http://www.agilent.com/; ComponentLink2Description: Datasheet; ComponentLink2URL: http://cp.literature.agilent.com/litweb/pdf/5988-5891EN.pdf
L1 = Inductor: 2A 4.7uH Magnetic Adhesive Inductor ±20% 2.9A SMD-2P,4x4mm Power Inductors ROHS
P5-P8 = TERMINAL BLOK 3: 3 pinski terminal blok konektor
P9-P12 = Header 3X2: Header, 3-Pin, Dual row; LatestRevisionDate: 17-Jul-2002; LatestRevisionNote: Re-released for DXP Platform.; Publisher: Altium Limited
P13-P16 = Header 4X2: Header, 4-Pin, Dual row; LatestRevisionDate: 17-Jul-2002; LatestRevisionNote: Re-released for DXP Platform.; Publisher: Altium Limited
P17 P20 = Header 8X2: Header, 8-Pin, Dual row; LatestRevisionDate: 17-Jul-2002; LatestRevisionNote: Re-released for DXP Platform.; Publisher: Altium Limited
P18 = Header 3: Header, 3-Pin; LatestRevisionDate: 17-Jul-2002; LatestRevisionNote: Re-released for DXP Platform.; Publisher: Altium Limited
P19 P21 = TERMINAL BLOK 2: Terminal blok konektor 3,5 mm
R23 R24 R26 R31-R35 = ERA3Y: as R1 on sheet DE-180824; Published: 17-Dec-2003; LatestRevisionDate: 19-Mar-2004; LatestRevisionNote: Silkscreen size reduced.; PackageDocument: Mar-2003; PackageReference: ERA-0603; Publisher: Altium Limited; Code_IPC: 1608 [0603]; ComponentLink1Description: Manufacturer Link; ComponentLink1URL: http://www.panasonic.com/industrial/components/resistive_products.htm; ComponentLink2Description: Datasheet; ComponentLink2URL: http://www.panasonic.com/industrial/components/pdf/AOA0000CE8.pdf
  R33: Value: 10K
  R34 R35: Value: 2K2
R25 R27-R30 R?#2 = ERAV: Metal Film Thermosensitive Chip Resistor, 0.56 Ohm to 10k Ohm Range, 5% Tolerance, 0603 Size, 0.063 W; Note: If flow soldering, adjust pad width of PCB Footprint to 0.7 - 0.8 times the width of the resistor.; Published: 17-Dec-2003; LatestRevisionDate: 19-Mar-2004; LatestRevisionNote: Silkscreen size reduced.; PackageDocument: Mar-2003; PackageReference: ERA-0603; Publisher: Altium Limited; Code_IPC: 1608 [0603]; ComponentLink1Description: Manufacturer Link; ComponentLink1URL: http://www.panasonic.com/industrial/components/resistive_products.htm; ComponentLink2Description: Datasheet; ComponentLink2URL: http://www.panasonic.com/industrial/components/pdf/AOF0000CE1.pdf
  R25: Value: 10K
  R27 R28: Value: 10R
  R29: Value: 1K2
  R30: Value: 2K2
R36 = ERA6Y: as R7 on sheet DE-180824; Published: 17-Dec-2003; LatestRevisionDate: 19-Mar-2004; LatestRevisionNote: Silkscreen size reduced.; PackageDocument: Mar-2003; PackageReference: ERA-0805; Publisher: Altium Limited; Code_IPC: 2012 [0805]; ComponentLink1Description: Manufacturer Link; ComponentLink1URL: http://www.panasonic.com/industrial/components/resistive_products.htm; ComponentLink2Description: Datasheet; ComponentLink2URL: http://www.panasonic.com/industrial/components/pdf/AOA0000CE8.pdf; Value: 10R
S1-S3 = TACKTILE_SWITCH
S4 = SW DIP-6: DIP Switch, 6 Position, SPST; Published: 24-Mar-1999; LatestRevisionDate: 17-Jul-2002; LatestRevisionNote: Re-released for DXP Platform.; PackageReference: DIP-12/SW; Publisher: Altium Limited; PackageDescription: DIP Switch; 12 Leads
U12 = STM32F030C8T6: ARM Cortex-M0 32-bit MCU, 64 KB Flash, 8 KB Internal RAM, 39 I/Os, 48-pin LQFP, -40 to 85 degC, Tray; FLASH Size (Prog) (kB): 64; I/Os (High Current): 39; Internal RAM Size (kB): 8; Operating Frequency(F) (Processor speed) (MHz): 48; Supply Voltage(Vcc) min (V): 2.4; DatasheetVersion: Rev. 1; PackageVersion: Rev. 6, 06/2013; PackageReference: LQFP48; PackageDescription: 48-Pin Low Profile Quad Flat Package, 7 x 7 mm Body, 0.5 mm Pitch; Supplier 1: Digi-Key; Supplier Part Number 1: 497-14043-ND; Supplier 2: Newark; Supplier Part Number 2: 06X3647; Supplier 3: Mouser; Supplier Part Number 3: 511-STM32F030C8T6; Core: ARM Cortex-M0; Packing: Tray; Mounting Technology: Surface Mount; PartNumber: STM32F030C8T6; ComponentLink1Description: Manufacturer URL; ComponentLink1URL: http://www.st.com/web/en/home.html; ComponentLink2Description: Datasheet; ComponentLink2URL: http://www.st.com/st-web-ui/static/active/en/resource/technical/document/datasheet/DM00088500.pdf; ComponentLink3Description: Package Specification; ComponentLink3URL: http://www.st.com/st-web-ui/static/active/en/resource/technical/document/datasheet/DM00058181.pdf
U13 = SN75176BD: Differential Bus Transceiver; Note: Receiver Hysteresis of 50mV Typical; Published: 15-May-2002; LatestRevisionDate: 13-Apr-2006; LatestRevisionNote: IPC-7351 Footprint Added.; DatasheetVersion: Sep-1989; PackageVersion: Jan-1998; PackageReference: D008; Publisher: Altium Limited; PackageDescription: 8-Pin Small Outline Integrated Circuit 1.27 mm Pitch; Code_IPC: SOIC127P600-8; ComponentLink1Description: Manufacturer Link; ComponentLink1URL: http://www.ti.com/; ComponentLink2Description: Datasheet; ComponentLink2URL: http://www-s.ti.com/sc/ds/sn75176b.pdf
U14 = TPD2E007DCKR: ESD Protection Array for AC Signal Data Interface, 2 Channels, -40 to +85 degC, 3-pin SC70 (DCK), Green (RoHS & no Sb/Br); Manufacturer: Texas Instruments; Breakdown Voltage(Min)(V): +/-14; IEC 61000-4-2 Air-Gap(+/- kV): 15; IEC 61000-4-2 Contact(+/- kV): 8; IO Leakage Current(nA): 50; SubFamily: ESD Solution; DatasheetVersion: SLVS796E; PackageVersion: revG, Jan-2007; PackageReference: DCK3; PackageDescription: 3-Pin Plastic Small-Outline Package, 0.65 mm Pitch, 2.1 mm Lead Span; Supplier 1: Digi-Key; Supplier Part Number 1: 296-25281-2-ND; Supplier 2: Digi-Key; Supplier Part Number 2: 296-25281-1-ND; Supplier 3: Digi-Key; Supplier Part Number 3: 296-25281-6-ND; Supplier 4: Farnell; Supplier Part Number 4: 2120465; Supplier 5: Newark; Supplier Part Number 5: 94T5089; Supplier 6: Newark; Supplier Part Number 6: 55R7554; Supplier 7: Mouser; Supplier Part Number 7: 595-TPD2E007DCKR; Eco-Plan: Green (RoHS & no Sb/Br); IO Capacitance(Typ)(pF): 15; Mounting Technology: Surface Mount; PartNumber: TPD2E007DCKR; ComponentLink1Description: Datasheet; ComponentLink1URL: http://www.ti.com/general/docs/lit/getliterature.tsp?genericPartNumber=TPD2E007&fileType=pdf; ComponentLink2Description: URL Link1; ComponentLink2URL: SamplesURL:http://www.ti.com/product/tpd2e007#samples
U15 = TLV803MDBZR: as U9 on sheet DE-180824; DatasheetVersion: SBVS157B; PackageVersion: revB, Apr-2005; PackageReference: DBZ3; PackageDescription: 3-Pin Plastic Small-Outline Package, 0.95 mm Pitch, 2.4 mm Lead Span; Supplier 1: Digi-Key; Supplier Part Number 1: 296-29194-2-ND; Supplier 2: Digi-Key; Supplier Part Number 2: 296-29194-1-ND; Supplier 3: Digi-Key; Supplier Part Number 3: 296-29194-6-ND; Supplier 4: Newark; Supplier Part Number 4: 58T0286; Supplier 5: Mouser; Supplier Part Number 5: 595-TLV803MDBZR; Mounting Technology: Surface Mount; Code_JEDEC: TO-236-AB; PartNumber: TLV803MDBZR; ComponentLink1Description: Datasheet; ComponentLink1URL: http://www.ti.com/general/docs/lit/getliterature.tsp?genericPartNumber=TLV803M&fileType=pdf
U16 = 24AA01T-I/OT: 1Kbit, 400kHz, 1.8V, I2C Serial EEPROM, 5-Pin SOT-23, Industrial Temperature, Tape and Reel; Published: 29-Jan-2009; DatasheetVersion: revJ, Jan-2009; PackageVersion: revBB, Aug-2009; PackageReference: SOT-23-OT5; Publisher: Altium Limited; PackageDescription: 5-Lead Plastic Small Outline Transistor (OT) [SOT-23]; Supplier 1: Digi-Key; Supplier Part Number 1: 24AA01T-I/OTTR-ND; Supplier 2: Digi-Key; Supplier Part Number 2: 24AA01T-I/OTCT-ND; Supplier 3: Digi-Key; Supplier Part Number 3: 24AA01T-I/OTDKR-ND; Supplier 4: Farnell; Supplier Part Number 4: 1331269; Code_IPC: SOT23-5; ComponentLink1Description: Datasheet; ComponentLink1URL: http://ww1.microchip.com/downloads/en/DeviceDoc/21711J.pdf; ComponentLink2Description: Packaging Specification; ComponentLink2URL: http://www.microchip.com/stellent/groups/techpub_sg/documents/packagingspec/en012702.pdf; ComponentLink3Description: Microchip.com Home; ComponentLink3URL: http://www.microchip.com/
U17 = AP63200: 2A synchronous  buck converter
U18 = REG1117-3.3: as U5 on sheet DE-180824; Published: 8-Jun-2000; LatestRevisionDate: 17-Jul-2002; LatestRevisionNote: Re-released for DXP Platform.; DatasheetVersion: Sep-1997; PackageVersion: revC; PackageReference: ZZ311; Publisher: Altium Limited; PackageDescription: SOT-223/SC-73; 4 Leads; Body 6.7 x 7.3 mm, inc. leads (LxW max); ComponentLink1Description: Manufacturer Link; ComponentLink1URL: http://www.ti.com/; ComponentLink2Description: Datasheet; ComponentLink2URL: http://www-s.ti.com/sc/ds/REG1117.pdf